# EasyEDA Pro project FRBC USB Interface Schematic V4.epro

# Schematic FRBC - USB interface_1
Board Name: FRBC - USB interface_1; Create Date: 2025-07-15; Page Name: Sheet_1; Project Name: FRBC - USB interface V4; Schematic Name: FRBC - USB interface_1; Update Date: 2025-07-15; Add into BOM: yes; Company: SHAPIRO; Convert to PCB: yes; Date: 2025-04-17; Draw By: JJ Shapiro; REV: 4; Sheet: 1/1; spicePre: .
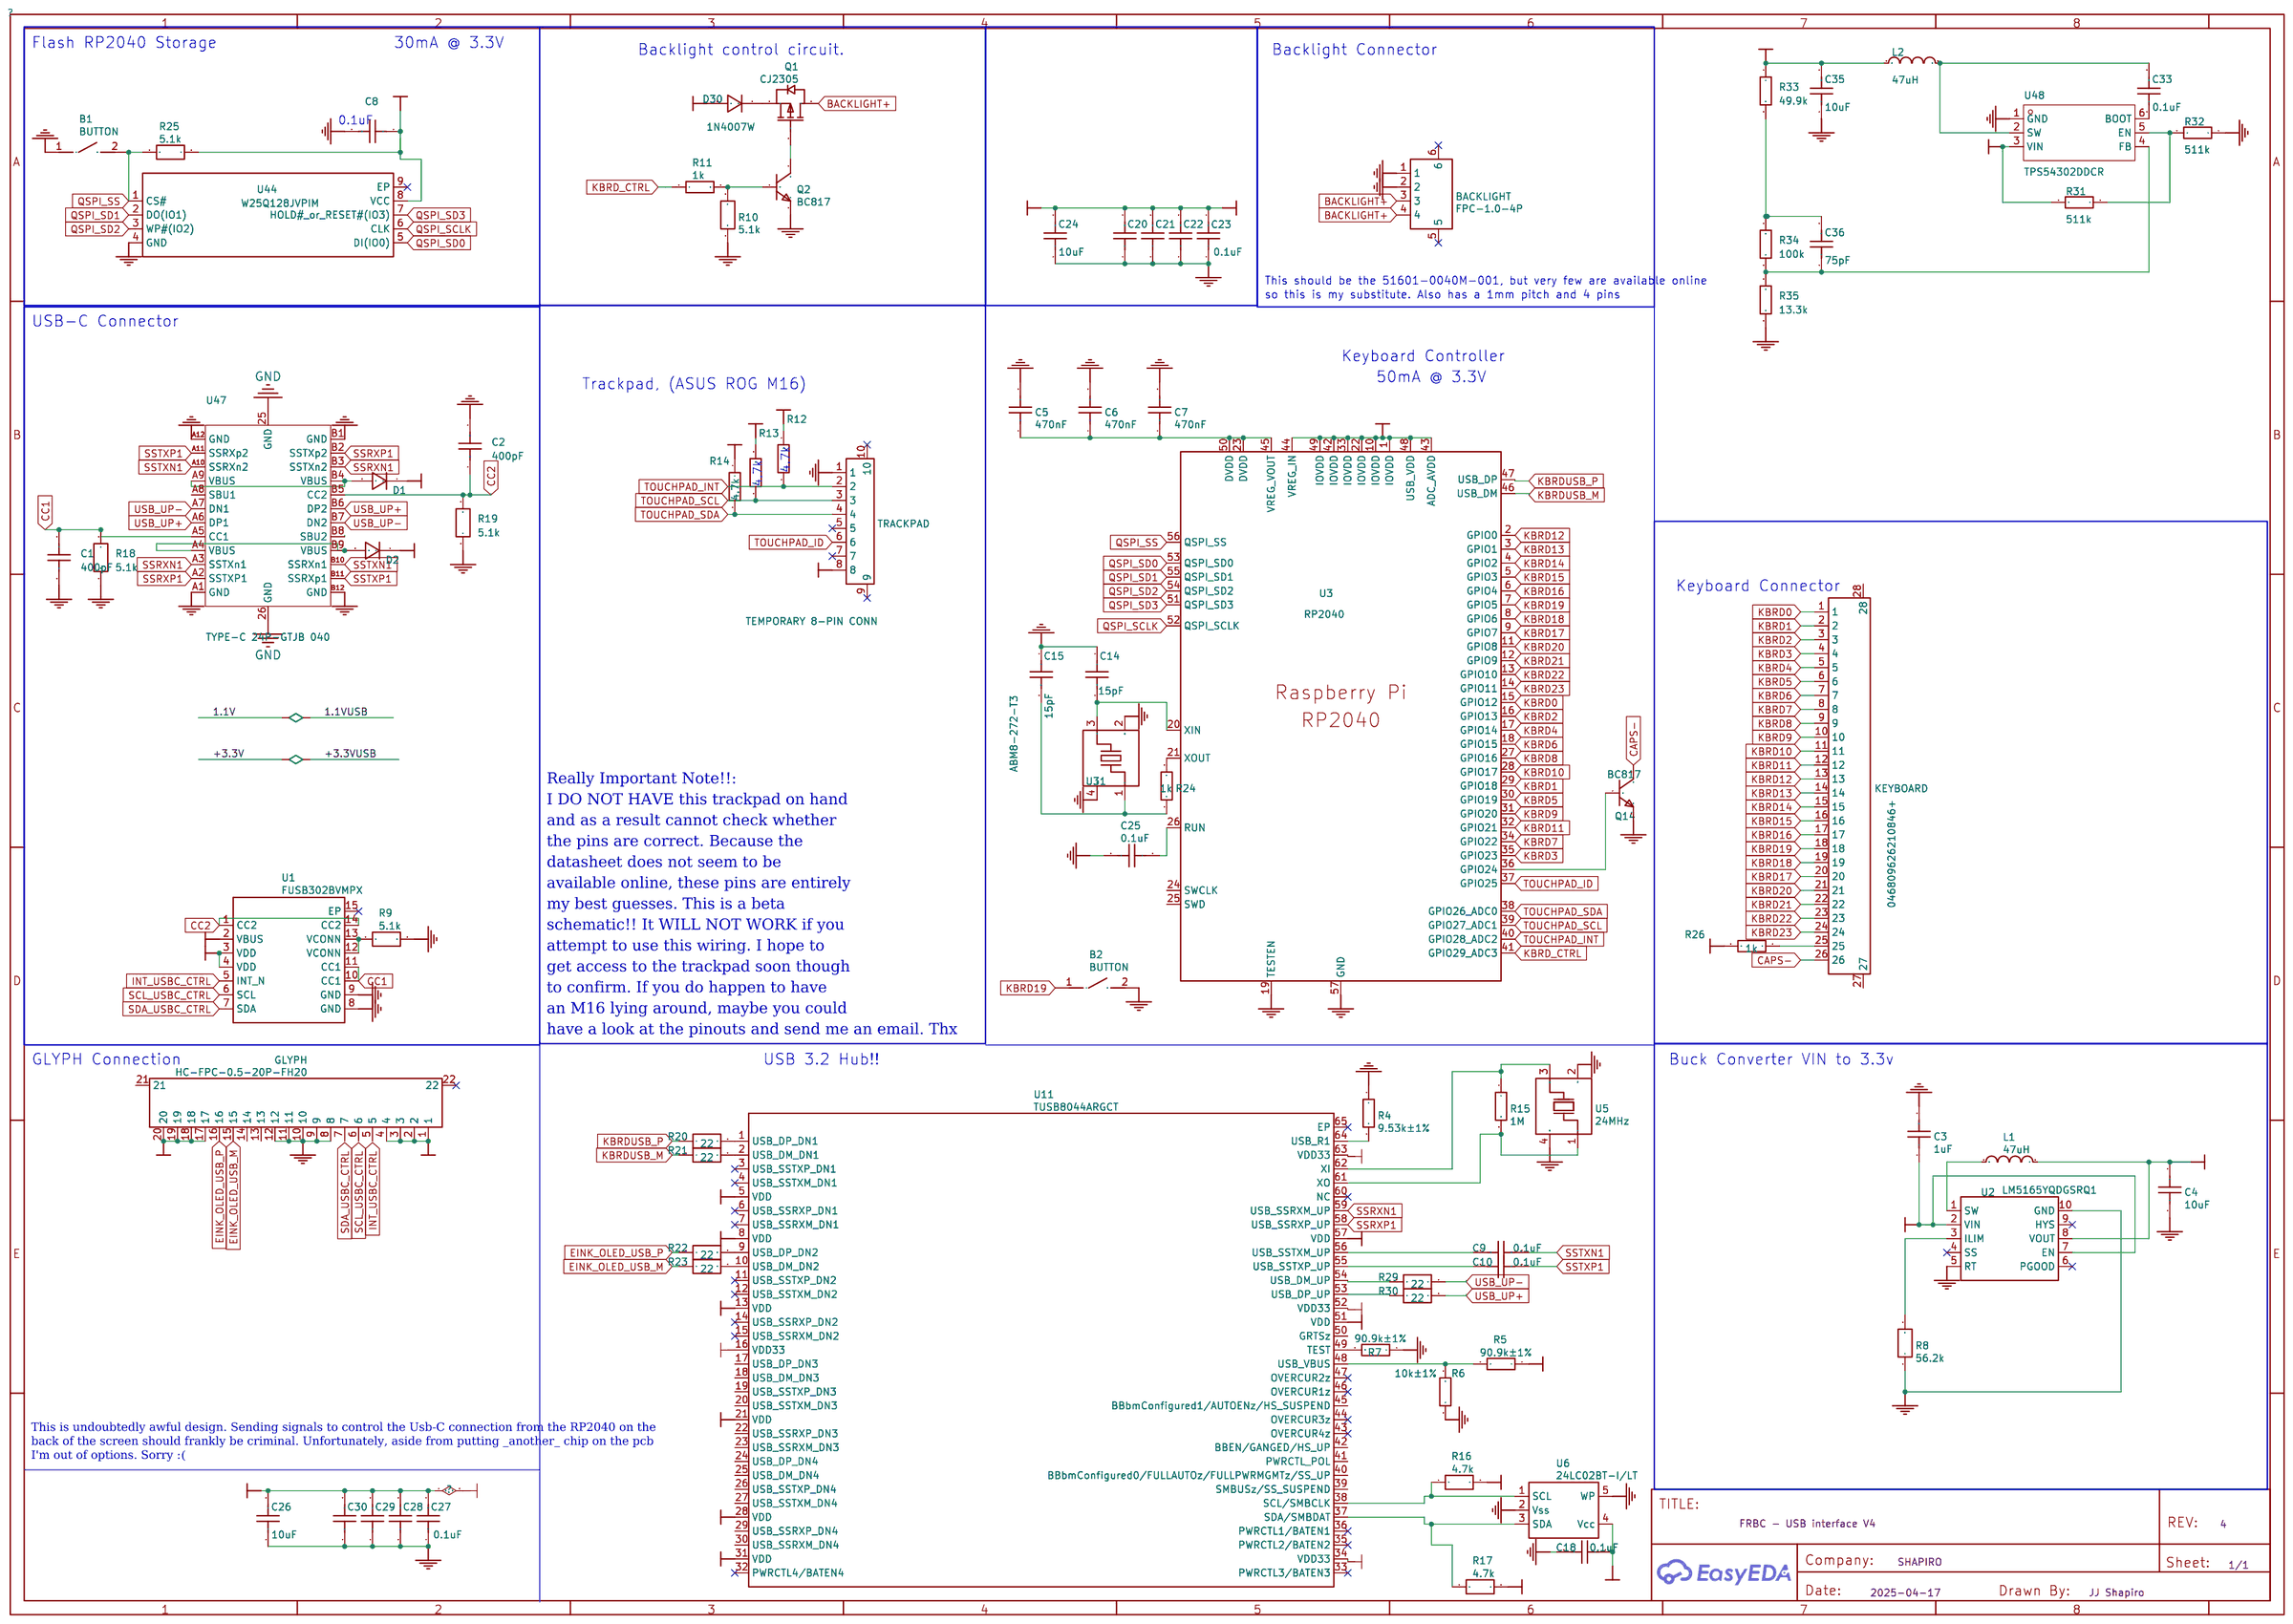
[diagram p0: schematic sheet]

## Parts
B1  BUTTON  [SW-SMD_L3.9-W2.9-LS4.9-L]
B2  BUTTON  [SW-SMD_L3.9-W2.9-LS4.9-L]
BACKLIGHT  FPC-1.0-4P  [FPC-SMD_4P-P1.00_HDGC_1.0K-ES-4PWB]
C1  400pF  [C0402]
C2  400pF  [C0402]
C3  1uF  [C0402]
C4  10uF  [C0402]
C5  470nF  [C0402]
C6  470nF  [C0402]
C7  470nF  [C0402]
C8  0.1uF  [C0402]
C9  0.1uF  [C0402]
C10  0.1uF  [C0402]
C14  15pF  [C0402]
C15  15pF  [C0402]
C18  0.1uF  [C0402]
C20  0.1uF  [C0402]
C21  0.1uF  [C0402]
C22  0.1uF  [C0402]
C23  0.1uF  [C0402]
C24  10uF  [C0402]
C25  0.1uF  [C0402]
C26  10uF  [C0402]
C27  0.1uF  [C0402]
C28  0.1uF  [C0402]
C29  0.1uF  [C0402]
C30  0.1uF  [C0402]
C33  0.1uF  [C0402]
C35  10uF  [C0402]
C36  75pF  [C0402]
D1  1N4007W  [SOD-123_L2.8-W1.8-LS3.7-RD]
D2  1N4007W  [SOD-123_L2.8-W1.8-LS3.7-RD]
D30  1N4007W  [SOD-123_L2.8-W1.8-LS3.7-RD]
GLYPH  HC-FPC-0.5-20P-FH20  [FPC-SMD_20P-P0.50_HC-FPC-0.5-20P-FH20]
KEYBOARD  046809626210846+  [FPC-SMD_26P-P0.50_046809626210846]
L1  47uH  [L0603]
L2  47uH  [L0603]
Q1  CJ2305  [SOT-23-3_L2.9-W1.3-P1.90-LS2.4-BR]
Q2  BC817  [SOT-23-3_L2.9-W1.3-P1.90-LS2.4-BR]
Q14  BC817  [SOT-23-3_L2.9-W1.3-P1.90-LS2.4-BR]
R4  9.53k±1%  [R0603]
R5  90.9k±1%  [R0603]
R6  10k±1%  [R0603]
R7  90.9k±1%  [R0603]
R8  56.2k  [R0402]
R9  5.1k  [R0402]
R10  5.1k  [R0402]
R11  1k  [R0402]
R12  4.7k - 0603  [R0402]
R13  4.7k - 0603  [R0402]
R14  4.7k  [R0402]
R15  1M  [R0603]
R16  4.7k  [R0402]
R17  4.7k  [R0402]
R18  5.1k  [R0402]
R19  5.1k  [R0402]
R20  22  [R0402]
R21  22  [R0402]
R22  22  [R0402]
R23  22  [R0402]
R24  1k  [R0402]
R25  5.1k  [R0402]
R26  1k  [R0402]
R29  22  [R0402]
R30  22  [R0402]
R31  511k  [R0603]
R32  511k  [R0603]
R33  49.9k  [R0603]
R34  100k  [R0603]
R35  13.3k  [R0603]
TRACKPAD  TEMPORARY 8-PIN CONN  [CONN-SMD_8P-P0.50_HC-FPC-0.5-8P-FHH20]
U1  FUSB302BVMPX  [MLP-14_L2.5-W2.5-P0.50-BL-EP]
U2  LM5165YQDGSRQ1  [VSSOP-10_L3.0-W3.0-P0.50-LS4.9-BL]
U3  RP2040  [LQFN-56_L7.0-W7.0-P0.4-EP]
U5  24MHz  [OSC-SMD_4P-XRCGB24M000F0L00R0]
U6  24LC02BT-I/LT  [SC-70-5_L2.0-W1.3-P0.65-LS2.1-BR]
U11  TUSB8044ARGCT  [VQFN-64_L9.0-W9.0-P0.50-TL-EP5.8]
U31  ABM8-272-T3  [CRYSTAL-SMD_4P-L3.2-W2.5-BL-2]
U44  W25Q128JVPIM  [WSON-8_L5.0-W6.0-P1.27-BL-EP]
U47  TYPE-C 24P-GTJB 040  [USB-C-SMD_TYPE-C-24P-GTJB-040]
U48  TPS54302DDCR  [SOT-23-6_L2.9-W1.6-P0.95-LS2.8-BL]

## Library data of the parts
B1 B2 = BUTTON: Supplier: LCSC; Supplier Part: C9900015607; Manufacturer: null; JLCPCB Part Class: Extended Part; Contributor: lcsc; spicePre: U
BACKLIGHT = FPC-1.0-4P: Supplier: LCSC; Supplier Part: C9900008975; Manufacturer: null; JLCPCB Part Class: Extended Part; Contributor: LCSC; spicePre: P
C1 C2 = 400pF: nameAlias: Value(F); Contributor: LCEDA_Lib; spicePre: C; spiceSymbolName: C_0402_US
C3 = 1uF: nameAlias: Value(F); Contributor: LCEDA_Lib; spicePre: C; spiceSymbolName: C_0603_US
C4 C24 C26 C33 C35 C36 = 10uF: nameAlias: Value(F); Contributor: LCEDA_Lib; spicePre: C; spiceSymbolName: C_0603_US
C5-C7 = 470nF: Supplier: LCSC; JLCPCB Part Class: Extended Part; nameAlias: Value; Contributor: lcsc; spicePre: C; spiceSymbolName: C0603C474K9RAC7867
C8-C10 C18 C20-C23 C25 C27-C30 = 0.1uF: nameAlias: Value(F); Contributor: LCEDA_Lib; spicePre: C; spiceSymbolName: C_0603_US
C14 C15 = 15pF: Supplier: LCSC; Supplier Part: C9900015864; Manufacturer: null; Manufacturer Part: 0201; JLCPCB Part Class: Extended Part; Contributor: lcsc; spicePre: C; spiceSymbolName: 0201_C9900015864
D1 D2 D30 = 1N4007W: Supplier: LCSC; Supplier Part: C328592; Manufacturer: BLUE ROCKET; Contributor: LCEDA_Lib; spicePre: D
GLYPH = HC-FPC-0.5-20P-FH20: Supplier: LCSC; Supplier Part: C19273932; Manufacturer: HC(虹成电子); Contributor: lcsc; spicePre: U
KEYBOARD = 046809626210846+: Supplier: LCSC; Supplier Part: C5466473; Manufacturer: Kyocera AVX; JLCPCB Part Class: Extended Part; Contributor: lcsc; spicePre: U
L1 L2 = 47uH: nameAlias: Value(H); Contributor: LCEDA_Lib; spicePre: L; spiceSymbolName: L0603_US
Q1 = CJ2305: Supplier: LCSC; Manufacturer: CJ(江苏长电/长晶); Supplier Part: C8549; JLCPCB Part Class: Extended Part; spicePre: Q
Q2 Q14 = BC817: Supplier: LCSC; Manufacturer: CJ(江苏长电/长晶); Manufacturer Part: BC817-40(RANGE:250-600); Supplier Part: C8589; JLCPCB Part Class: Extended Part; spicePre: Q
R4 = 9.53k±1%: Supplier: LCSC; JLCPCB Part Class: Extended Part; nameAlias: Value; Contributor: LCSC; spicePre: R; spiceSymbolName: CR0603F0R3P05
R5 R7 = 90.9k±1%: Supplier: LCSC; JLCPCB Part Class: Extended Part; nameAlias: Value; Contributor: LCSC; spicePre: R; spiceSymbolName: CR0603F0R3P05
R6 = 10k±1%: Supplier: LCSC; JLCPCB Part Class: Extended Part; nameAlias: Value; Contributor: LCSC; spicePre: R; spiceSymbolName: CR0603F0R3P05
R8 = 56.2k: nameAlias: Value(Ω); Contributor: LCEDA_Lib; spicePre: R; spiceSymbolName: R_0402_EU
R9 R10 R18 R19 R25 = 5.1k: nameAlias: Value(Ω); Contributor: LCEDA_Lib; spicePre: R; spiceSymbolName: R_0402_EU
R11 R24 R26 = 1k: Supplier: LCSC; JLCPCB Part Class: Extended Part; nameAlias: Value; Contributor: LCSC; spicePre: R; spiceSymbolName: CR0603F0R3P05
R12 R13 = 4.7k - 0603: Supplier: LCSC; JLCPCB Part Class: Extended Part; nameAlias: Value; Contributor: LCSC; spicePre: R; spiceSymbolName: CR0603F0R3P05
R14 = 4.7k: Supplier: LCSC; JLCPCB Part Class: Extended Part; nameAlias: Value; Contributor: LCSC; spicePre: R; spiceSymbolName: CR0603F0R3P05
R15 R31-R35 = 1M: Supplier: LCSC; JLCPCB Part Class: Extended Part; nameAlias: Value; Contributor: LCSC; spicePre: R; spiceSymbolName: CR0603F0R3P05
R16 R17 = 4.7k: nameAlias: Value(Ω); Contributor: LCEDA_Lib; spicePre: R; spiceSymbolName: R_0402_EU
R20-R23 R29 R30 = 22: nameAlias: Value(Ω); Contributor: LCEDA_Lib; spicePre: R; spiceSymbolName: R_0402_EU
TRACKPAD = TEMPORARY 8-PIN CONN: Supplier: LCSC; Supplier Part: C19273938; Manufacturer: HC(虹成电子); Manufacturer Part: HC-FPC-0.5-8P-FHH20; Contributor: lcsc; spicePre: U; spiceSymbolName: HC-FPC-0.5-8P-FHH20
U1 = FUSB302BVMPX: Supplier: LCSC; Supplier Part: C891308; Manufacturer: onsemi(安森美); JLCPCB Part Class: Extended Part; Contributor: LCSC; spicePre: U
U2 = LM5165YQDGSRQ1: Supplier: LCSC; Supplier Part: C2071473; Manufacturer: TI(德州仪器); JLCPCB Part Class: Extended Part; Contributor: LCSC; spicePre: U
U3 = RP2040: Supplier: LCSC; Supplier Part: C2040; Manufacturer: Raspberry Pi(树莓派); JLCPCB Part Class: Extended Part; Contributor: LCSC; spicePre: U
U5 = 24MHz: Supplier: LCSC; Supplier Part: C1986063; Manufacturer: muRata(村田); Manufacturer Part: XRCGB24M000F1H17R0; JLCPCB Part Class: Extended Part; Contributor: lcsc; nameAlias: Value; spicePre: U; spiceSymbolName: XRCGB24M000F1H17R0
U6 = 24LC02BT-I/LT: Supplier: LCSC; Supplier Part: C614826; Manufacturer: MICROCHIP(美国微芯); JLCPCB Part Class: Extended Part; Contributor: lcsc; spicePre: U
U11 = TUSB8044ARGCT: Supplier: LCSC; Supplier Part: C5216239; Manufacturer: TI(德州仪器); JLCPCB Part Class: Extended Part; Contributor: lcsc; spicePre: U
U31 = ABM8-272-T3: Supplier: LCSC; Supplier Part: C9900091606; Manufacturer: null; Contributor: lcsc; spicePre: U
U44 = W25Q128JVPIM: Supplier: LCSC; Supplier Part: C2641199; Manufacturer: WINBOND(华邦); JLCPCB Part Class: Extended Part; Contributor: LCSC; spicePre: U
U47 = TYPE-C 24P-GTJB 040: Connector Type:Type-C Standard:USB 3.1 Gender:Male Mounting Style:Clamp plate Number of Contacts:24P Number of Ports:1 Current Rating - Power (Max):5A Contact Material:- Contact Plating:- Operating Temperature Range:-40℃~+85℃ Operating Temperature Range:-; LCSC Part Name: Type-C 公 夹板; Supplier Part: C3151751; Manufacturer: SHOU HAN(首韩); Supplier Footprint: SMD; JLCPCB Part Class: Extended Part; Datasheet: https://atta.szlcsc.com/upload/public/pdf/source/20220627/7E6A801537BBF5FC92E560D05DD164AC.pdf; Supplier: LCSC; Connector Type: Type-C; Standard: USB 3.1; Gender: Male; Mounting Style: Clamp plate; Number of Contacts: 24P; Number of Ports: 1; Current Rating - Power (Max): 5A; Operating Temperature Range: -40℃~+85℃; Rated Voltage (Max): 20V; Connect-Disconnect Life: 10,000 times; Core Colour: Black
U48 = TPS54302DDCR_C311983: Function:Step-down type Output Type:Fixed Input Voltage:4.5V~28V Input Voltage:4.5V~28V Output Voltage:5V Output Voltage:5V Output Current:3A Switching Frequency:400kHz Switching Frequency:400kHz Operating Temperature:-40℃~+125℃ Operating Temperature:-40℃; LCSC Part Name: 4.5V至28V输入、3A输出、EMI友好的同步降压转换器; Supplier Part: C311983; Manufacturer: TI(德州仪器); Supplier Footprint: TSOT-23-6; JLCPCB Part Class: Extended Part; Datasheet: https://www.ti.com/cn/lit/gpn/tps54302; Supplier: LCSC; Function: Step-down type; Output Type: Fixed; Input Voltage: 4.5V~28V; Output Voltage: 5V; Output Current: 3A; Switching Frequency: 400kHz; Operating Temperature: -40℃~+125℃; Synchronous Rectification: Yes; Number of Outputs: 1; Topology: Step-down; Quiescent Current (Iq): 45uA; Switch tube (built-in/external): Built-in

## Nets
1.1V: C20.2 C21.2 C22.2 C23.2 C24.2 U11.5(VDD) U11.8(VDD) U11.13(VDD) U11.21(VDD) U11.28(VDD) U11.31(VDD) U11.51(VDD) U11.57(VDD)
+3.3V: C4.2 C8.1 C18.1 C26.2 C27.2 C28.2 C29.2 C30.2 L1.2 R12.1 R13.1 R14.1 R16.2 R17.2 R25.1 R31.2 U1.3(VDD) U1.4(VDD) U2.8(VOUT) U3.1(IOVDD) U3.10(IOVDD) U3.22(IOVDD) U3.33(IOVDD) U3.42(IOVDD) U3.43(ADC_AVDD) U3.44(VREG_IN) U3.48(USB_VDD) U3.49(IOVDD) U6.4(Vcc) U11.16(VDD33) U11.34(VDD33) U11.52(VDD33) U11.63(VDD33) U44.8(VCC) U48.3(VIN)
+5V: C35.2 D30.2 L2.1 R26.2 R33.1 TRACKPAD.8
GND: B1.1 B2.2 BACKLIGHT.1 BACKLIGHT.2 C1.1 C2.2 C3.2 C4.1 C5.2 C6.2 C7.2 C8.2 C14.1 C15.1 C18.2 C20.1 C21.1 C22.1 C23.1 C24.1 C25.2 C26.1 C27.1 C28.1 C29.1 C30.1 C35.1 GLYPH.8 GLYPH.9 GLYPH.10 GLYPH.11 GLYPH.12 Q2.2(E) Q14.2(E) R4.1 R6.2 R7.1 R8.1 R9.2 R10.1 R18.1 R19.1 R32.1 R35.2 TRACKPAD.1 U1.8(GND) U1.9(GND) U2.5(RT) U2.10(GND) U3.19(TESTEN) U3.57(GND) U5.2(GND) U5.4(GND) U6.2(Vss) U6.5(WP) U31.2(GND) U31.4(GND) U44.4(GND) U47.25(GND) U47.26(GND) U47.A1(GND) U47.A12(GND) U47.B1(GND) U47.B12(GND) U48.1(GND)
VBUS: C3.1 D1.1 D2.1 GLYPH.1 GLYPH.2 GLYPH.3 GLYPH.4 GLYPH.17 GLYPH.18 GLYPH.19 GLYPH.20 R5.1 U1.2(VBUS) U2.2(VIN) U2.7(EN)
BACKLIGHT+: BACKLIGHT.3 BACKLIGHT.4 Q1.3(D)
CAPS-: KEYBOARD.26 Q14.3(C)
CC1: C1.2 R18.2 U1.10(CC1) U1.11(CC1) U47.A5(CC1)
CC2: C2.1 R19.2 U1.1(CC2) U1.14(CC2) U47.B5(CC2)
EINK_OLED_USB_M: GLYPH.15 R23.1
EINK_OLED_USB_P: GLYPH.16 R22.1
INT_USBC_CTRL: U1.5(INT_N)
KBRD0: KEYBOARD.1 U3.15(GPIO12)
KBRD1: KEYBOARD.2 U3.29(GPIO18)
KBRD2: KEYBOARD.3 U3.16(GPIO13)
KBRD3: KEYBOARD.4 U3.35(GPIO23)
KBRD4: KEYBOARD.5 U3.17(GPIO14)
KBRD5: KEYBOARD.6 U3.30(GPIO19)
KBRD6: KEYBOARD.7 U3.18(GPIO15)
KBRD7: KEYBOARD.8 U3.34(GPIO22)
KBRD8: KEYBOARD.9 U3.27(GPIO16)
KBRD9: KEYBOARD.10 U3.31(GPIO20)
KBRD10: KEYBOARD.11 U3.28(GPIO17)
KBRD11: KEYBOARD.12 U3.32(GPIO21)
KBRD12: KEYBOARD.13 U3.2(GPIO0)
KBRD13: KEYBOARD.14 U3.3(GPIO1)
KBRD14: KEYBOARD.15 U3.4(GPIO2)
KBRD15: KEYBOARD.16 U3.5(GPIO3)
KBRD16: KEYBOARD.17 U3.6(GPIO4)
KBRD17: KEYBOARD.20 U3.9(GPIO7)
KBRD18: KEYBOARD.19 U3.8(GPIO6)
KBRD19: B2.1 KEYBOARD.18 U3.7(GPIO5)
KBRD20: KEYBOARD.21 U3.11(GPIO8)
KBRD21: KEYBOARD.22 U3.12(GPIO9)
KBRD22: KEYBOARD.23 U3.13(GPIO10)
KBRD23: KEYBOARD.24 U3.14(GPIO11)
KBRD_CTRL: R11.1 U3.41(GPIO29_ADC3)
KBRDUSB_M: R21.1 U3.46(USB_DM)
KBRDUSB_P: R20.1 U3.47(USB_DP)
QSPI_SCLK: U3.52(QSPI_SCLK) U44.6(CLK)
QSPI_SD0: U3.53(QSPI_SD0) U44.5(DI(IO0))
QSPI_SD1: U3.55(QSPI_SD1) U44.2(DO(IO1))
QSPI_SD2: U3.54(QSPI_SD2) U44.3(WP#(IO2))
QSPI_SD3: U3.51(QSPI_SD3) U44.7(HOLD# or RESET#(IO3))
QSPI_SS: B1.2 R25.2 U3.56(QSPI_SS) U44.1(CS#)
SCL_USBC_CTRL: U1.6(SCL)
SDA_USBC_CTRL: U1.7(SDA)
SSRXN1: U11.59(USB_SSRXM_UP) U47.A3(SSTXn1) U47.B3(SSTXn2)
SSRXP1: U11.58(USB_SSRXP_UP) U47.A2(SSTXP1) U47.B2(SSTXp2)
SSTXN1: C9.1 U47.A10(SSRXn2) U47.B10(SSRXn1)
SSTXP1: C10.1 U47.A11(SSRXp2) U47.B11(SSRXp1)
TOUCHPAD_ID: TRACKPAD.6 U3.37(GPIO25)
TOUCHPAD_INT: R12.2 TRACKPAD.2 U3.40(GPIO28_ADC2)
TOUCHPAD_SCL: R13.2 TRACKPAD.3 U3.39(GPIO27_ADC1)
TOUCHPAD_SDA: R14.2 TRACKPAD.4 U3.38(GPIO26_ADC0)
USB_UP+: R30.2 U47.A6(DP1) U47.B6(DP2)
USB_UP-: R29.2 U47.A7(DN1) U47.B7(DN2)
Net-(C5-1): C5.1 C6.1 C7.1 U3.23(DVDD) U3.45(VREG_VOUT) U3.50(DVDD)
Net-(C9-2): C9.2 U11.56(USB_SSTXM_UP)
Net-(C10-2): C10.2 U11.55(USB_SSTXP_UP)
Net-(C14-2): C14.2 U3.20(XIN) U31.3
Net-(C15-2): C15.2 R24.1 U31.1
Net-(C25-1): C25.1 U3.26(RUN)
Net-(C33-1): C33.1 U48.6(BOOT)
Net-(C33-2): C33.2 L2.2 U48.2(SW)
Net-(C36-1): C36.1 R34.2 R35.1 U48.4(FB)
Net-(C36-2): C36.2 R33.2 R34.1
Net-(D1-2): D1.2 U47.A9(VBUS) U47.B4(VBUS)
Net-(D2-2): D2.2 U47.A4(VBUS) U47.B9(VBUS)
Net-(D30-1): D30.1 Q1.2(S)
Net-(KEYBOARD-25): KEYBOARD.25 R26.1
Net-(L1-1): L1.1 U2.1(SW)
Net-(Q1-1): Q1.1(G) Q2.3(C)
Net-(Q2-1): Q2.1(B) R10.2 R11.2
Net-(Q14-1): Q14.1(B) U3.36(GPIO24)
Net-(R4-2): R4.2 U11.64(USB_R1)
Net-(R5-2): R5.2 R6.1 U11.48(USB_VBUS)
Net-(R7-2): R7.2 U11.49(TEST)
Net-(R8-2): R8.2 U2.3(ILIM)
Net-(R9-1): R9.1 U1.12(VCONN) U1.13(VCONN)
Net-(R15-1): R15.1 U5.3(OSC2) U11.62(XI)
Net-(R15-2): R15.2 U5.1(OSC1) U11.61(XO)
Net-(R16-1): R16.1 U6.1(SCL) U11.38(SCL/SMBCLK)
Net-(R17-1): R17.1 U6.3(SDA) U11.37(SDA/SMBDAT)
Net-(R20-2): R20.2 U11.1(USB_DP_DN1)
Net-(R21-2): R21.2 U11.2(USB_DM_DN1)
Net-(R22-2): R22.2 U11.9(USB_DP_DN2)
Net-(R23-2): R23.2 U11.10(USB_DM_DN2)
Net-(R24-2): R24.2 U3.21(XOUT)
Net-(R29-1): R29.1 U11.54(USB_DM_UP)
Net-(R30-1): R30.1 U11.53(USB_DP_UP)
Net-(R31-1): R31.1 R32.2 U48.5(EN)

Not connected (* = marked no-connect by the designer): BACKLIGHT 5* 6*; GLYPH 5 6 7 13 14 21 22*; KEYBOARD 27 28; TRACKPAD 5* 7* 9* 10*; U1 15(EP)*; U2 4(SS)* 6(PGOOD)* 9(HYS)*; U3 24(SWCLK) 25(SWD); U11 3(USB_SSTXP_DN1)* 4(USB_SSTXM_DN1)* 6(USB_SSRXP_DN1)* 7(USB_SSRXM_DN1)* 11(USB_SSTXP_DN2)* 12(USB_SSTXM_DN2)* 14(USB_SSRXP_DN2)* 15(USB_SSRXM_DN2)* 17(USB_DP_DN3) 18(USB_DM_DN3) 19(USB_SSTXP_DN3) 20(USB_SSTXM_DN3) 22(USB_SSRXP_DN3) 23(USB_SSRXM_DN3) 24(USB_DP_DN4) 25(USB_DM_DN4) 26(USB_SSTXP_DN4) 27(USB_SSTXM_DN4) 29(USB_SSRXP_DN4) 30(USB_SSRXM_DN4) 32(PWRCTL4/BATEN4)* 33(PWRCTL3/BATEN3)* 35(PWRCTL2/BATEN2)* 36(PWRCTL1/BATEN1)* 39(SMBUSz/SS_SUSPEND) 40(BBbmConfigured0/FULLAUTOz/FULLPWRMGMTz/SS_UP) 41(PWRCTL_POL) 42(BBEN/GANGED/HS_UP) 43(OVERCUR4z)* 44(OVERCUR3z)* 45(BBbmConfigured1/AUTOENz/HS_SUSPEND) 46(OVERCUR1z)* 47(OVERCUR2z)* 50(GRTSz) 60(NC)* 65(EP)*; U44 9(EP)*; U47 A8(SBU1) B8(SBU2)

## Notes on the sheet
- Flash RP2040 Storage
- 30mA @ 3.3V
- Backlight control circuit.
- Backlight Connector
- 0.1uF
- This should be the 51601-0040M-001, but very few are available online
- so this is my substitute. Also has a 1mm pitch and 4 pins
- USB-C Connector
- Keyboard Controller
- Trackpad, (ASUS ROG M16)
- 50mA @ 3.3V
- 4.7k
- 4.7k
- Keyboard Connector
- Really Important Note!!:
- I DO NOT HAVE this trackpad on hand
- and as a result cannot check whether
- the pins are correct. Because the
- datasheet does not seem to be
- available online, these pins are entirely
- my best guesses. This is a beta
- schematic!! It WILL NOT WORK if you
- attempt to use this wiring. I hope to
- get access to the trackpad soon though
- to confirm. If you do happen to have
- an M16 lying around, maybe you could
- have a look at the pinouts and send me an email. Thx
- GLYPH Connection
- USB 3.2 Hub!!
- Buck Converter VIN to 3.3v
- This is undoubtedly awful design. Sending signals to control the Usb-C connection from the RP2040 on the
- back of the screen should frankly be criminal. Unfortunately, aside from putting _another_ chip on the pcb
- I'm out of options. Sorry :(
